# Altium schematic sheet esq.SchDoc
size A4; SheetNumber: 1; SheetTotal: 1; Titulo: CIRCUITO LAMPARA-SIMULADO; Alumno: GRUPO 16; profesor: -; curso: 6to B; TPN: -; NLista: X; Asignatura: PROYECTO; Año: 2020; ModifiedDate: -; Rule: PcbType=ProtelPcb
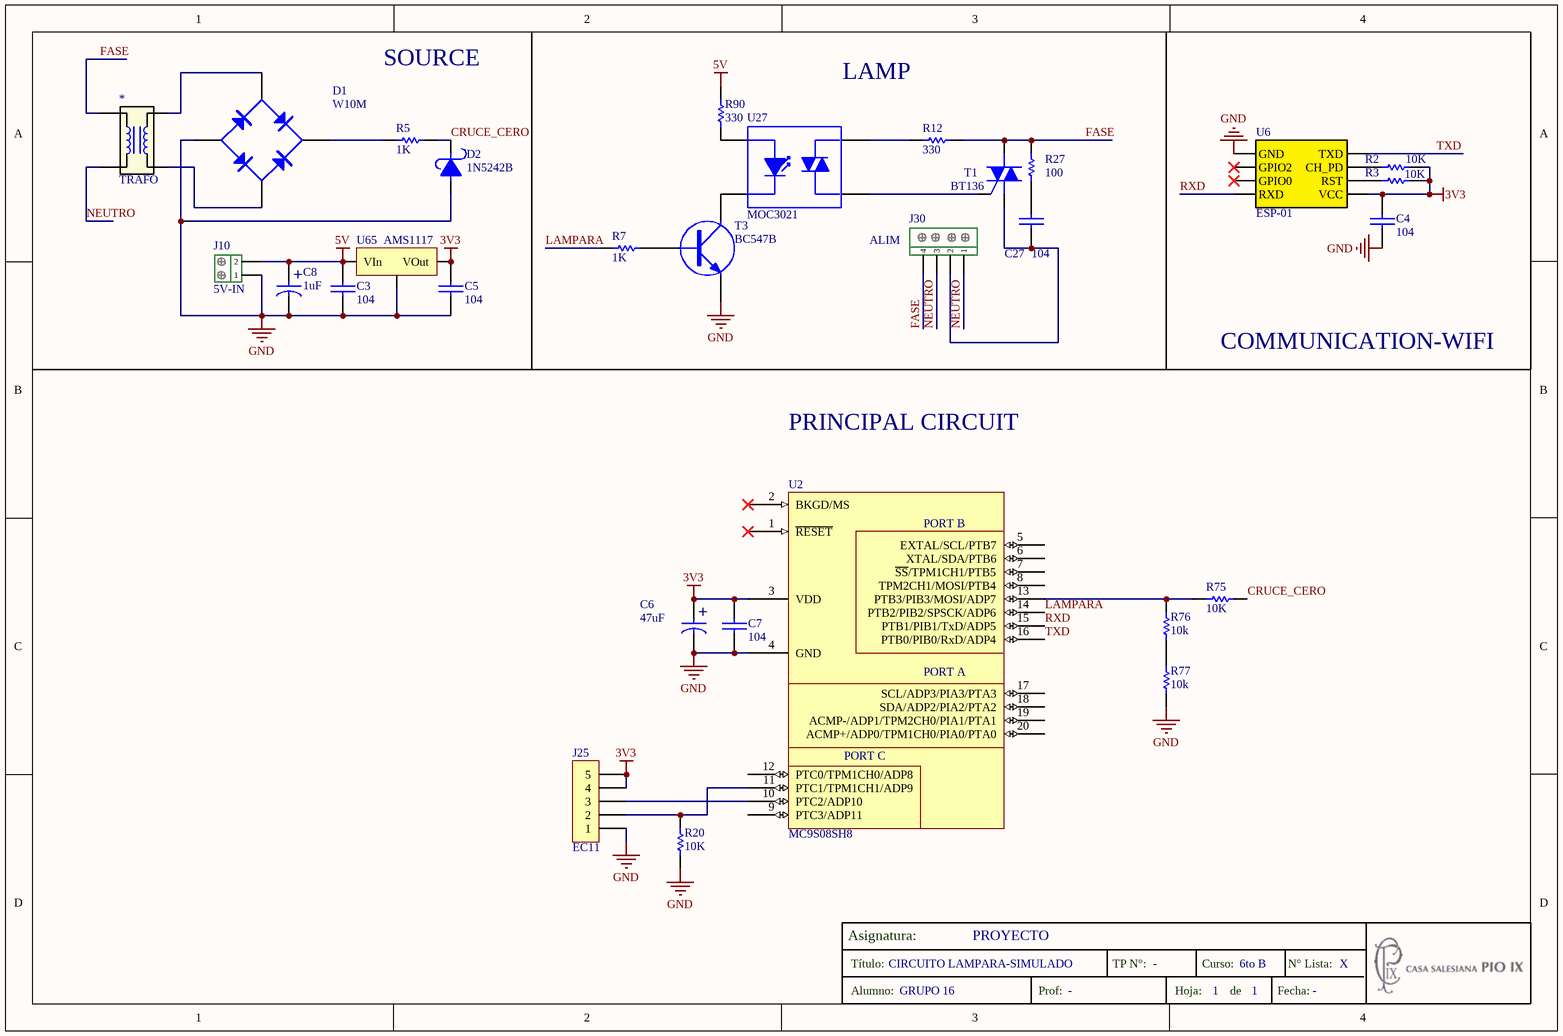
[diagram p0: esq.SchDoc]

## Parts
*  TRAFO  [trafo chico]
C3  104  [0805]
C4  104  [0805]
C5  104  [0805]
C6  47uF  [CAP_SMD]
C7  104  [0805]
C8  1uF  [CAP_SMD]
C27  104  [0805]
D1  W10M  [PUENTE - W10M]
D2  1N5242B  [Diodo]
J10  5V-IN  [BORNERA2]
J25  EC11  [BORNERA5]
J30  ALIM  [BORNERA4]
R2  10K  [0805]
R3  10K  [0805]
R5  1K  [0805]
R7  1K  [0805]
R12  330  [0805]
R20  10K  [0805]
R27  100  [0805]
R75  10K  [0805]
R76  10k  [0805]
R77  10k  [0805]
R90  330  [0805]
T1  BT136  [BT136]
T3  BC547B  [SOT23]
U2  MC9S08SH8  [SH8]
U6  ESP-01  [ESP-01]
U27  MOC3021  [MOC3021]
U65  AMS1117  [AMS1117]

## Nets
3V3: C4.2 C5.1 C6.1 C7.1 J25.4 J25.5 R2.1 R3.1 U2.3(VDD) U6.8(VCC) U65.3(VOut)
5V: C3.1 C8.1 J10.2 R90.1 U65.1(VIn)
GND: C3.2 C4.1 C5.2 C6.2 C7.2 C8.2 D1.3(V-) D2.1 J10.1 J25.1 R20.1 R77.1 T3.3(E) U2.4(GND) U6.1(GND) U65.2(GND)
CRUCE_CERO: D2.2 R5.2 R75.1
FASE: *.1 J30.4 R12.1 R27.2 T1.2(M2)
LAMPARA: R7.2 U2.14(PTB2/PIB2/SPSCK/ADP6)
NEUTRO: *.5 J30.1 J30.3
RXD: U2.15(PTB1/PIB1/TxD/ADP5) U6.4(RXD)
TXD: U2.16(PTB0/PIB0/RxD/ADP4) U6.5(TXD)
Net*_7: *.7 D1.2(AC)
Net*_9: *.9 D1.4(AC)
NetC27_1: C27.1 R27.1
NetC27_2: C27.2 J30.2 T1.1(M1)
NetD1_1: D1.1(V+) R5.1
NetJ25_2: J25.2 R20.2 U2.11(PTC1/TPM1CH1/ADP9)
NetJ25_3: J25.3 U2.10(PTC2/ADP10)
NetR2_2: R2.2 U6.6(CH_PD)
NetR3_2: R3.2 U6.7(RST)
NetR7_1: R7.1 T3.1(B)
NetR12_2: R12.2 U27.6(C)
NetR75_2: R75.2 R76.2 U2.13(PTB3/PIB3/MOSI/ADP7)
NetR76_1: R76.1 R77.2
NetR90_2: R90.2 U27.1(A)
NetT1_3: T1.3(G) U27.4(E)
NetT3_2: T3.2(C) U27.2(K)

Not connected (* = marked no-connect by the designer): U2 1(~{RESET})* 2(BKGD/MS)* 5(EXTAL/SCL/PTB7) 6(XTAL/SDA/PTB6) 7(~{SS}/TPM1CH1/PTB5) 8(TPM2CH1/MOSI/PTB4) 9(PTC3/ADP11) 12(PTC0/TPM1CH0/ADP8) 17(SCL/ADP3/PIA3/PTA3) 18(SDA/ADP2/PIA2/PTA2) 19(ACMP-/ADP1/TPM2CH0/PIA1/PTA1) 20(ACMP+/ADP0/TPM1CH0/PIA0/PTA0); U6 2(GPIO2)* 3(GPIO0)*

## Notes on the sheet
- SOURCE
- LAMP
- COMMUNICATION-WIFI
- PRINCIPAL CIRCUIT
- Asignatura:
- Título:
- TP N°:
- Curso:
- N° Lista:
- Alumno:
- Prof:
- Hoja:
- de
- Fecha:
- (in symbol CAPPOL) +
- (in symbol MC9S08SH8) PORT B; PORT A; PORT C

## Library data of the parts
C3-C5 C7 C27 = CAP: Autor: Guido Spataro; Data: Libebal; Fecha: 07/04/19
C6 C8 = CAPPOL: Cap polarizado
D1 = PUENTE
D2 = DIODO SCHOTTKY: Diodo; Autor: Guido Spataro; DAta: https://assets.nexperia.com/documents/outline-drawing/SOD123.pdf; Fecha: 07/04/19
J10 = Bornera_2: Bornera de 2 pines; Autor: Guido Spataro; Datasheet: Libebal; Fecha: 07/04/19
J25 = BORNERA 5
J30 = BORNERA 4
R2 R3 R5 R7 R12 R20 R27 R75-R77 R90 = RES: Resistencia; Autor: Guido Spataro; Data: Libebal; Fecha: 07/04/19
T3 = TRANSISTOR NPN
U2 = MC9S08SH8: Micro controlador; Autor: Guido Spataro; data: https://www.nxp.com/docs/en/data-sheet/MC9S08SH8.pdf; Fecha: 07/04/19
U27 = MOC3021: OPTO-ACOPLADOR